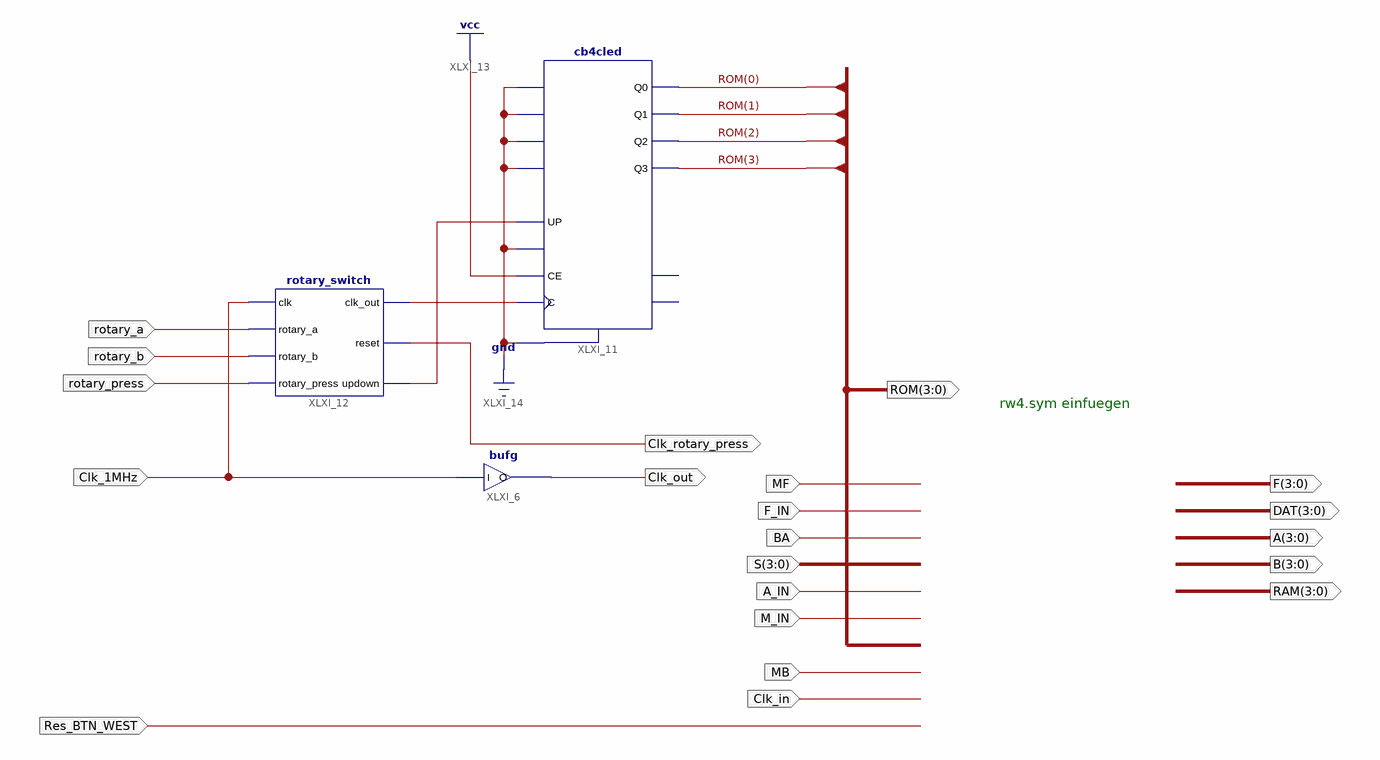
[diagram p0: schematic sheet 1]
// Xilinx ISE schematic board_rw4.sch (spartan3e) as structural Verilog: 3 symbols, 21 ports
module board_rw4 (
  input  BA,
  input  [3:0] S,
  input  Clk_1MHz,
  input  rotary_a,
  input  rotary_b,
  input  rotary_press,
  input  Res_BTN_WEST,
  input  Clk_in,
  input  MB,
  input  M_IN,
  input  A_IN,
  input  F_IN,
  input  MF,
  output [3:0] ROM,
  output [3:0] F,
  output Clk_out,
  output Clk_rotary_press,
  output [3:0] DAT,
  output [3:0] A,
  output [3:0] B,
  output [3:0] RAM
);

  wire XLXN_14, XLXN_66;

  bufg XLXI_6 (.I(Clk_1MHz), .O(Clk_out));
  cb4cled XLXI_11 (
    .C(XLXN_66), .CE(1'b1), .CLR(1'b0), .D0(1'b0), .D1(1'b0), .D2(1'b0), .D3(1'b0), .L(1'b0), .UP(XLXN_14),
    .Q0(ROM[0]), .Q1(ROM[1]), .Q2(ROM[2]), .Q3(ROM[3]));  // open: CEO, TC
  rotary_switch XLXI_12 (
    .clk(Clk_1MHz), .rotary_a(rotary_a), .rotary_b(rotary_b), .rotary_press(rotary_press), .clk_out(XLXN_66),
    .reset(Clk_rotary_press), .updown(XLXN_14));

  // Notes on the sheet:
  //   rw4.sym einfuegen
endmodule
